# EAGLE design MotorBoardHoles (EAGLE 8.4.3)
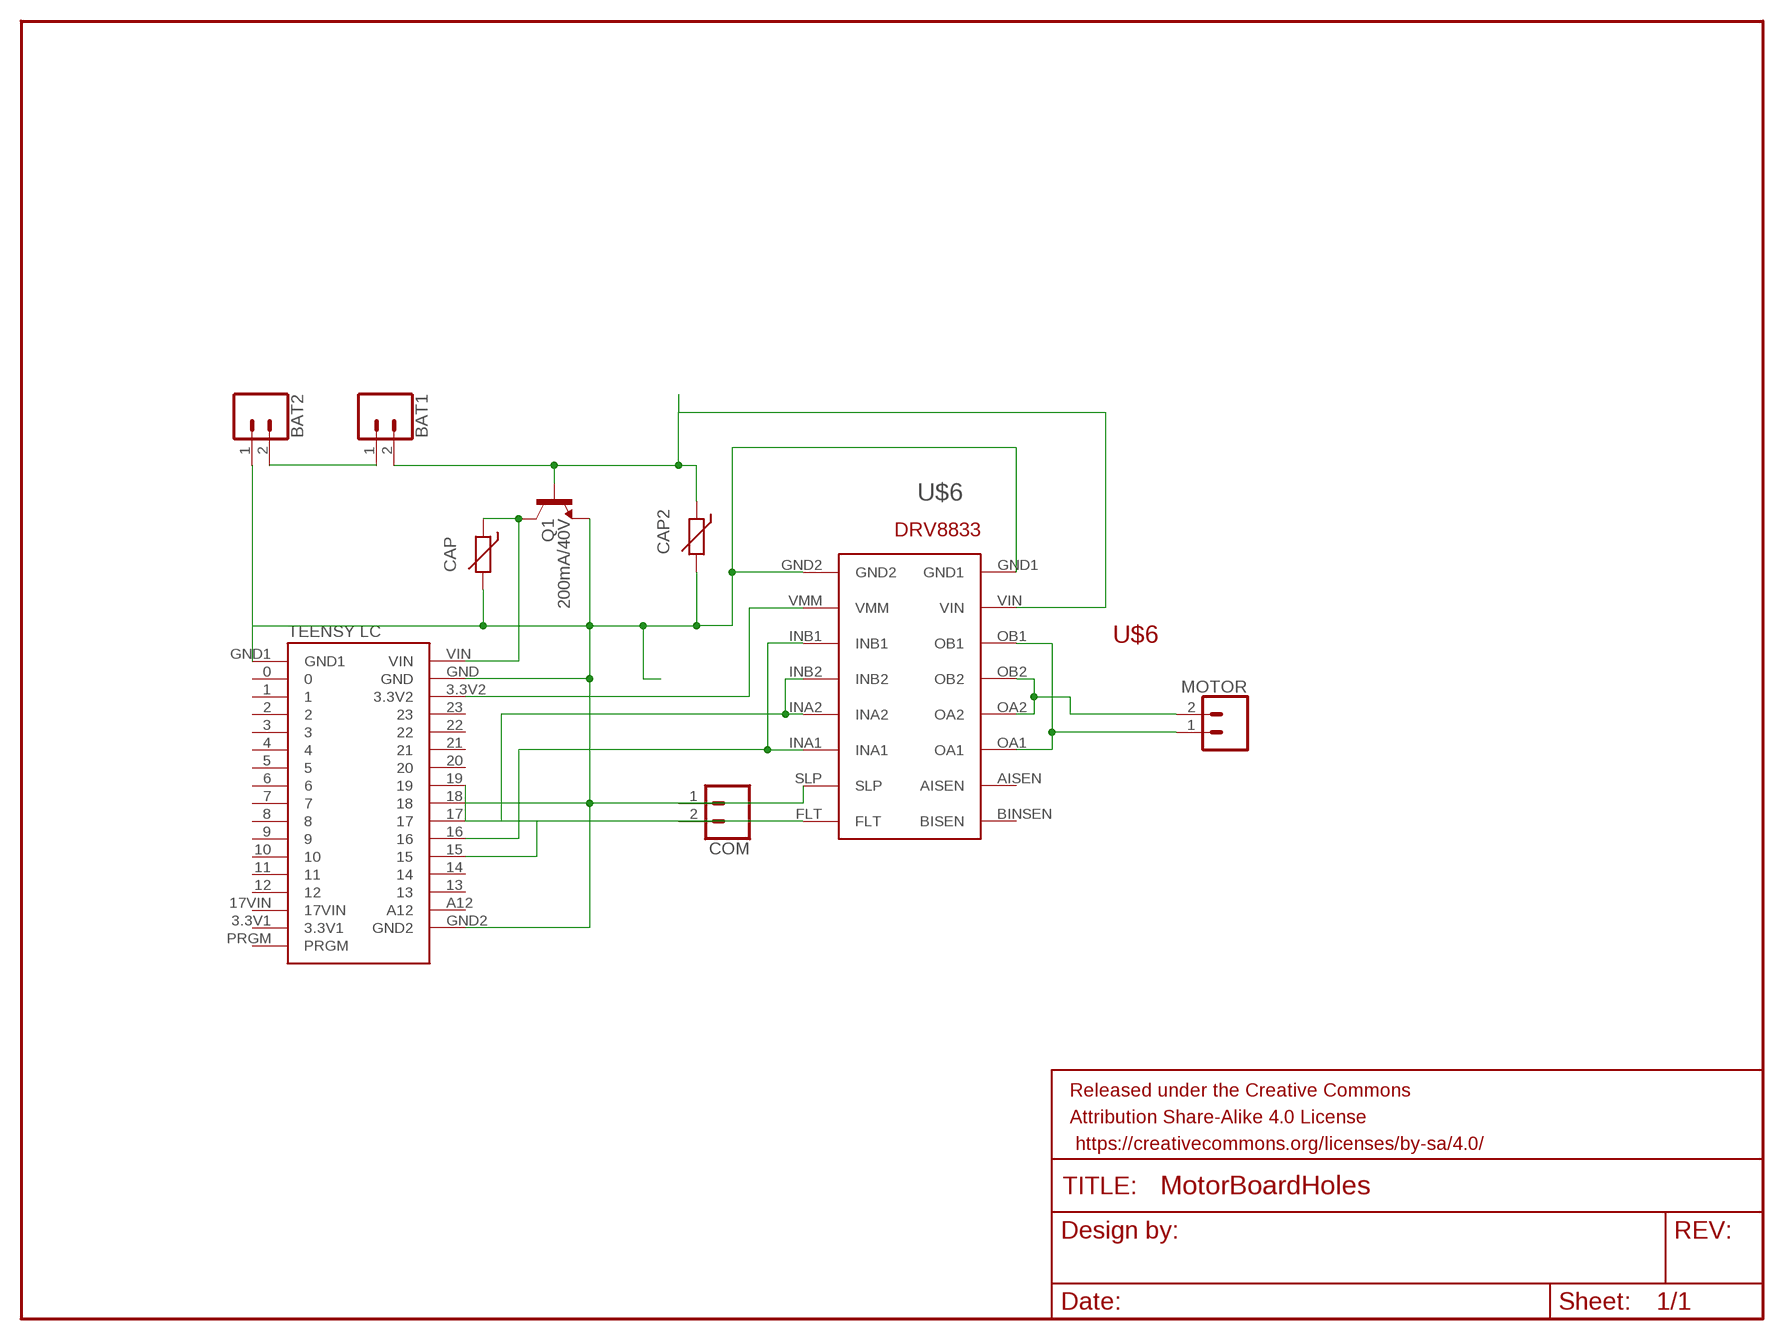
[diagram p0: schematic, sheet 1]

## Parts
BAT1  CONN_02JST-PTH-2  [JST-2-PTH]
BAT2  CONN_02JST-PTH-2  [JST-2-PTH]
CAP  THERMISTOR_R-5  [R-5]
CAP2  THERMISTOR_R-5  [R-5]
COM  CONN_02JST-PTH-2  [JST-2-PTH]
FRAME1  FRAME-LETTER  [CREATIVE_COMMONS]
MOTOR  CONN_02JST-PTH-2  [JST-2-PTH]
Q1  200mA/40V  TRANS_NPN-2N3904  [TO-92]
U$1  TEENSYLC  [TEENSYLC]
U$6  POLOLU-DRV8833  [POLOLU-DRV8833]

## Nets
3.3: U$1.3.3V2 U$6.VMM
5.5V: CAP.1 Q1.3(C) U$1.VIN
7.V4: BAT1.2 CAP2.1 Q1.2(B) U$6.VIN
BAT_INT: BAT1.1 BAT2.2
GND: BAT2.1 CAP2.2 CAP.2 COM.1 Q1.1(E) U$1.GND U$1.GND1 U$1.GND2 U$6.GND1 U$6.GND2
N$1: U$1.16 U$6.INA1 U$6.INB1
N$2: U$1.17 U$6.INA2 U$6.INB2
N$3: MOTOR.1 U$6.OA1 U$6.OB1
N$4: COM.2 U$1.15
N$5: MOTOR.2 U$6.OA2 U$6.OB2
N$6: U$1.18 U$6.SLP
N$7: U$1.19 U$6.FLT
Unconnected: U$1.0 U$1.1 U$1.2 U$1.3 U$1.3.3V1 U$1.4 U$1.5 U$1.6 U$1.7 U$1.8 U$1.9 U$1.10 U$1.11 U$1.12 U$1.13 U$1.14 U$1.17VIN U$1.20 U$1.21 U$1.22 U$1.23 U$1.A12 U$1.PRGM U$6.AISEN U$6.BINSEN(BISEN)

## Library data of the parts
BAT1 BAT2 COM MOTOR = SparkFun-Connectors:CONN_02: Multi connection point. Often used as Generic Header-pin footprint for 0.1 inch spaced/style header connections On any of the 0.1 inch spaced packages, you can populate with these: Break Away Headers - Straight <https://www.sparkfun.com/products/116> (PRT-00116) Break Away Male Headers - Right Angle <https://www.sparkfun.com/products/553> (PRT-00553) Female Headers <https://www.sparkfun.com/products/115> (PRT-00115) Break Away Headers - Machine Pin <https://www.sparkfun.com/products/117> (PRT-00117) Break Away Female Headers - Swiss Machine Pin <https://www.sparkfun.com/products/743> (PRT-00743) For SCREWTERMINALS and SPRING TERMINALS visit here: Screw Terimnals on SparkFun.com <https://www.sparkfun.com/search/results?term=Screw+Terminals> (5mm/3.5mm/2.54mm spacing) This device is also useful as a general connection point to wire up your design to another part of your project. Our various solder wires solder well into these plated through hole pads. Hook-Up Wire - Assortment (Stranded, 22 AWG) <https://www.sparkfun.com/products/11375> (PRT-11375) Hook-Up Wire - Assortment (Solid Core, 22 AWG) <https://www.sparkfun.com/products/11367> (PRT-11367) View the entire wire category on our website here <https://www.sparkfun.com/categories/141> Special notes: Molex polarized connector foot print use with: PRT-08233 with associated crimp pins and housings. 2.54_SCREWTERM for use with PRT-10571. 3.5mm Screw Terminal footprints for PRT-08084 5mm Screw Terminal footprints for use with PRT-08432; PROD_ID: CONN-09863; SKU: PRT-09914
CAP CAP2 = discrete:THERMISTOR_: Thermo Resistor
FRAME1 = SparkFun-Aesthetics:FRAME-LETTER: Schematic Frame - Letter Standard 8.5x11 US Letter frame
Q1 = SparkFun-DiscreteSemi:TRANS_NPN: NPN transistor Current controlled devices typically used to amplify current or used as a switch. BC547 - COM-08928 <http://www.sparkfun.com/products/8928> (TO-92 45V 100mA) (1.Collector 2.Base 3.Emitter) 2N3904 - COM-00521 <http://www.sparkfun.com/products/521> (TO-92 40V 200mA) (1.Emitter 2.Base 3.Collector) P2N2222A - COM-12852 <http://www.sparkfun.com/products/12852> (TO-92 40V 600mA) (1.Collector 2.Base 3.Emitter); PROD_ID: TRANS-08447
U$1 = IchiCustoms:TEENSYLC
U$6 = Pololu_Driver_DRV8833:POLOLU-DRV8833: Created by: Deltarios DRV8833 pololu dual drive controller, PCB-ready device

## Board
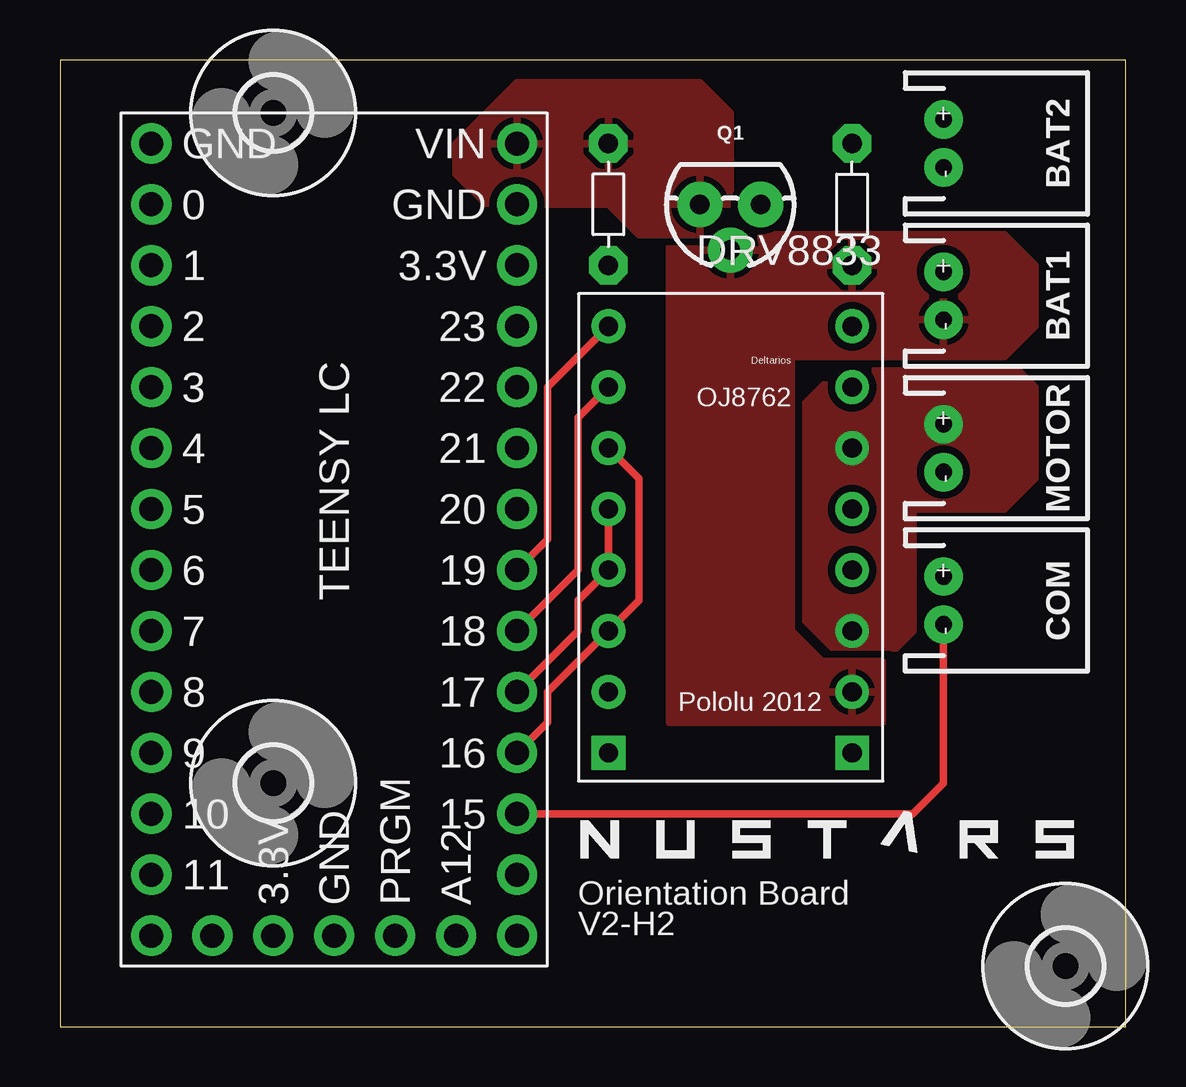
[diagram p1: board, top side]
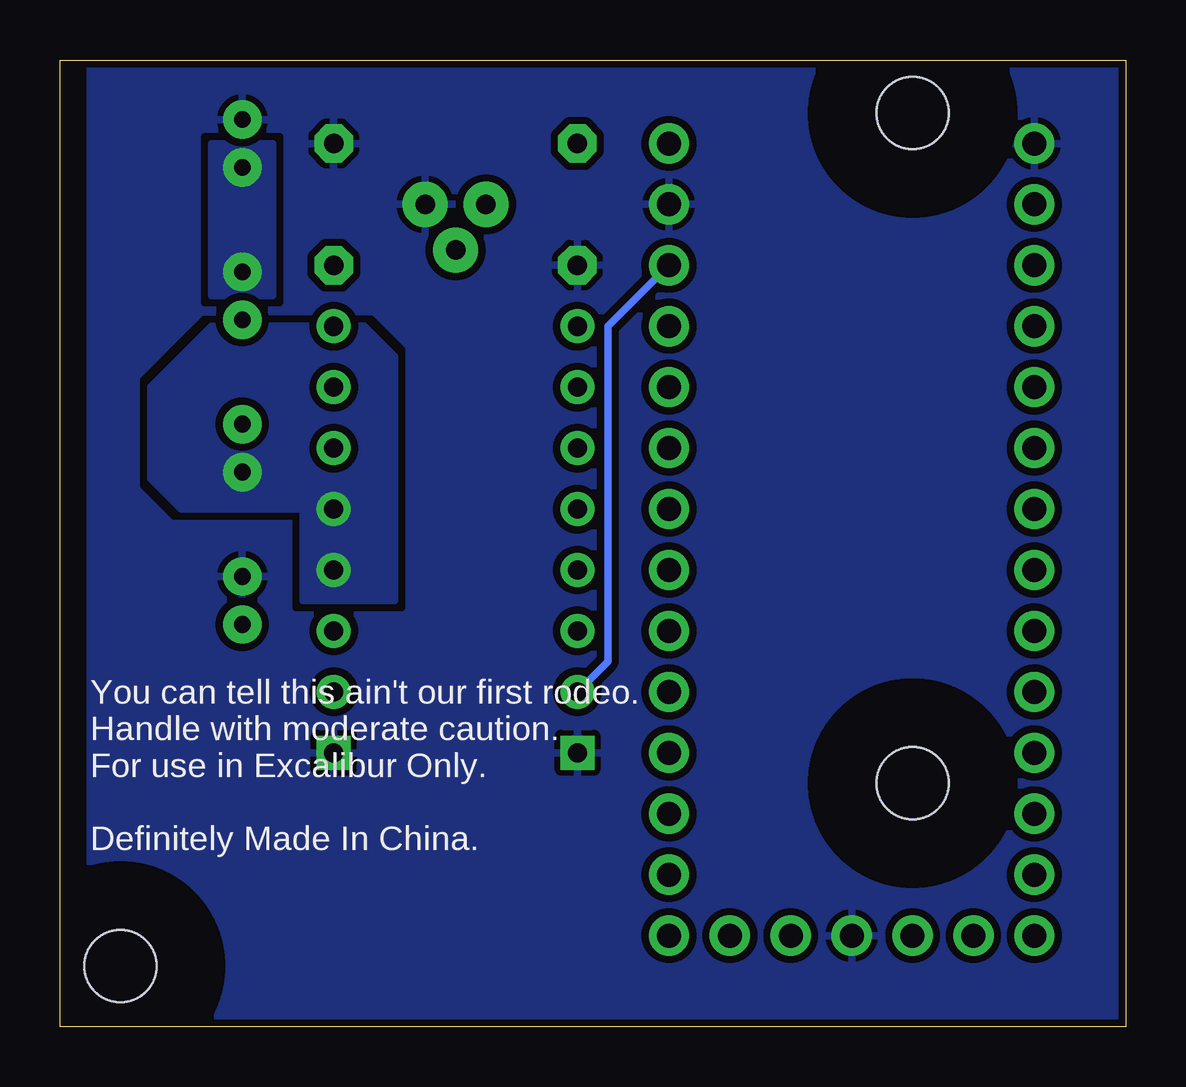
[diagram p2: board, bottom side, seen from below]

Size 44.43 x 40.31 mm. Coordinates in mm from the lower left corner, seen from the top.
Outline: 0,0 44.43,0 44.43,40.31 0,40.31 0,0
Copper layers (1*16): Top 0.035mm / dielectric 1.5mm / Bottom 0.035mm
Design rules "SparkFun": minimum track width 8mil, minimum drill 20mil, track to track 8mil, track to pad 8mil, pad to pad 8mil, via to via 8mil, smd to smd 8mil, copper to edge 10mil, drill to drill 8mil, minimum pad ring 12mil, minimum via ring 10mil, stop-mask expansion 4mil, vias tented up to drill 25mil, thermal gap 10mil

### Footprints (pad centres in the part's own frame; a part is rotated, then mirrored left to right if it is on the bottom)
JST-2-PTH = drill 0.7 pad 1.6: 1 -1,0; 2 1,0
R-5 = drill 0.813 pad 1.6 octagon: 1 -2.54,0; 2 2.54,0
TO-92 = drill 0.813 pad 1.88: 1 -1.27,0; 2 0,1.905; 3 1.27,0
TEENSYLC = drill 1 pad 1.676: 0 3.81,1.27; 1 6.35,1.27; 2 8.89,1.27; 3 11.43,1.27; 3.3V1 34.29,6.35; 3.3V2 6.35,16.51; 4 13.97,1.27; 5 16.51,1.27; 6 19.05,1.27; 7 21.59,1.27; 8 24.13,1.27; 9 26.67,1.27; 10 29.21,1.27; 11 31.75,1.27; 12 34.29,1.27; 13 34.29,16.51; 14 31.75,16.51; 15 29.21,16.51; 16 26.67,16.51; 17 24.13,16.51; 17VIN 34.29,3.81; 18 21.59,16.51; 19 19.05,16.51; 20 16.51,16.51; 21 13.97,16.51; 22 11.43,16.51; 23 8.89,16.51; A12 34.29,13.97; GND 1.27,1.27; GND1 34.29,8.89; GND2 3.81,16.51; PRGM 34.29,11.43; VIN 1.27,16.51
3,0 = hole 3: 0,0
POLOLU-DRV8833 = drill 0.8: AISEN -3.81,-7.62; BINSEN -3.81,-10.16; FLT 6.35,-10.16; INA1 6.35,-5.08; INA2 6.35,-2.54; INB1 6.35,2.54; INB2 6.35,0; OA1 -3.81,-5.08; OA2 -3.81,-2.54; OB1 -3.81,2.54; OB2 -3.81,0; SLP 6.35,-7.62; VIN -3.81,5.08; VMM 6.35,5.08 | drill 0.8 square: GND1 -3.81,7.62; GND2 6.35,7.62

### Placement (x,y rotation side)
BAT1  36.83,30.48 270 top
BAT2  36.83,36.83 270 top
CAP  22.86,34.29 270 top
CAP2  33.02,34.29 90 top
COM  36.83,17.78 270 top
FRAME1  -88.9,43.18 0 top  (outside the outline)
MOTOR  36.83,24.13 270 top
Q1  27.94,34.29 180 top
U$1  2.54,38.1 270 top
U$3  [3,0]  8.89,38.1 0 top
U$4  [3,0]  8.89,10.16 0 top
U$5  [3,0]  41.91,2.54 0 top
U$6  29.21,19.05 180 top

### Tracks (layer width: path | path; a pad name or v marks a point on that pad's centre or on a via)
3.3
  Bottom 0.305: U$6.VMM 21.59,15.24 21.59,29.21 U$1.3.3V2
5.5V
  pour Top (isolate 0.305): 27.94,33.02 24.13,33.02 22.86,34.29 21.59,34.29 17.78,34.29 16.51,35.56 16.51,36.83 17.78,38.1 19.05,39.37 24.13,39.37 26.67,39.37 27.94,38.1
7.V4
  pour Top (isolate 0.305, rank 2): 25.4,33.02 39.37,33.02 40.64,31.75 40.64,29.21 39.37,27.94 30.48,27.94 29.21,26.67 25.4,27.94
  pour Top (isolate 0.305): 27.94,30.48 25.4,27.94 29.21,30.48
  pour Top (isolate 0.305): 25.4,27.94 25.4,12.7 34.29,12.7 34.29,15.24 31.75,15.24 30.48,16.51 30.48,27.94
BAT_INT
  pour Bottom (isolate 0.305, no thermals): 35.56,36.83 38.1,36.83 38.1,30.48 35.56,30.48
GND
  pour Bottom (isolate 0.305, rank 6): 0,40.64 0,0 43.18,0 43.18,40.64
N$1
  Top 0.305: U$6.INA1 24.13,22.86 24.13,17.78 U$6.INB1 20.32,13.97 20.32,12.7 U$1.16
N$2
  Top 0.305: U$6.INA2 U$6.INB2 21.59,17.78 21.59,16.51 U$1.17
N$3
  pour Top (isolate 0.305, rank 3, no thermals): 30.48,24.13 30.48,15.24 34.29,15.24 35.56,16.51 35.56,21.59 35.56,24.13 34.29,25.4 31.75,25.4
  pour Top (isolate 0.305, rank 3, no thermals): 34.29,29.21 30.48,25.4 30.48,22.86 31.75,21.59 39.37,21.59 40.64,22.86 40.64,26.67 38.1,29.21
N$4
  Top 0.305: COM.2 36.83,10.16 35.56,8.89 U$1.15
N$5
  pour Bottom (isolate 0.305, no thermals): 30.48,22.86 30.48,17.78 34.29,17.78 34.29,22.86
  pour Bottom (isolate 0.305, no thermals): 31.75,29.21 30.48,27.94 30.48,22.86 31.75,21.59 39.37,21.59 40.64,22.86 40.64,26.67 38.1,29.21
N$6
  Top 0.305: U$6.SLP 21.59,25.4 21.59,19.05 U$1.18
N$7
  Top 0.305: U$1.19 20.32,20.32 20.32,26.67 U$6.FLT

### Text on the board
tPlace: + | - | + | - | + | - | + | - | Orientation Board | V2-H2 | D:/ichi/Library/Pictures/E89FC659-C5E8-4355-A63B-FB59E9E2BA1C.bmp
bPlace: You can tell this ain't our first rodeo. / Handle with moderate caution. / For use in Excalibur Only. / / Definitely Made In China.